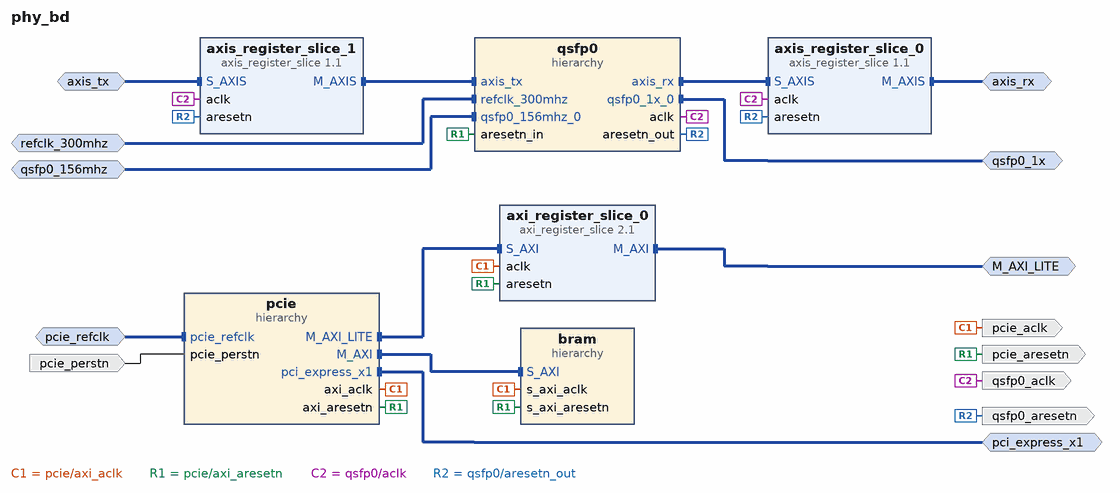
[diagram p0: block diagram of the top level]
# Vivado block design phy_bd, xcu200-fsgd2104-2-e, Vivado 2019.1.3
create_bd_design phy_bd

create_bd_intf_port -mode Master -vlnv xilinx.com:interface:pcie_7x_mgt_rtl:1.0 pci_express_x1
create_bd_intf_port -mode Slave -vlnv xilinx.com:interface:diff_clock_rtl:1.0 pcie_refclk
create_bd_intf_port -mode Slave -vlnv xilinx.com:interface:diff_clock_rtl:1.0 qsfp0_156mhz
set_property -dict {CONFIG.FREQ_HZ 156250000} [get_bd_intf_ports qsfp0_156mhz]
create_bd_intf_port -mode Master -vlnv xilinx.com:interface:gt_rtl:1.0 qsfp0_1x
create_bd_intf_port -mode Slave -vlnv xilinx.com:interface:diff_clock_rtl:1.0 refclk_300mhz
create_bd_intf_port -mode Master -vlnv xilinx.com:interface:aximm_rtl:1.0 M_AXI_LITE
set_property -dict [list \
  CONFIG.ADDR_WIDTH 32 \
  CONFIG.DATA_WIDTH 32 \
  CONFIG.FREQ_HZ 62500000 \
  CONFIG.HAS_BURST 0 \
  CONFIG.HAS_CACHE 0 \
  CONFIG.HAS_LOCK 0 \
  CONFIG.HAS_QOS 0 \
  CONFIG.HAS_REGION 0 \
  CONFIG.PROTOCOL AXI4LITE \
] [get_bd_intf_ports M_AXI_LITE]
create_bd_intf_port -mode Master -vlnv xilinx.com:interface:axis_rtl:1.0 axis_rx
set_property -dict {CONFIG.FREQ_HZ 156250000 CONFIG.PHASE 0} [get_bd_intf_ports axis_rx]
create_bd_intf_port -mode Slave -vlnv xilinx.com:interface:axis_rtl:1.0 axis_tx
set_property -dict [list \
  CONFIG.FREQ_HZ 156250000 \
  CONFIG.HAS_TKEEP 1 \
  CONFIG.HAS_TLAST 1 \
  CONFIG.HAS_TREADY 1 \
  CONFIG.HAS_TSTRB 0 \
  CONFIG.LAYERED_METADATA undef \
  CONFIG.PHASE 0 \
  CONFIG.TDATA_NUM_BYTES 8 \
  CONFIG.TDEST_WIDTH 0 \
  CONFIG.TID_WIDTH 0 \
  CONFIG.TUSER_WIDTH 1 \
] [get_bd_intf_ports axis_tx]
create_bd_port -dir I -type rst pcie_perstn
set_property -dict {CONFIG.POLARITY ACTIVE_LOW} [get_bd_ports pcie_perstn]
create_bd_port -dir O -type clk pcie_aclk
create_bd_port -dir O pcie_aresetn
create_bd_port -dir O qsfp0_aclk
create_bd_port -dir O qsfp0_aresetn

create_bd_cell -type hier bram
create_bd_cell -type hier pcie
create_bd_cell -type hier qsfp0
create_bd_cell -type ip -vlnv xilinx.com:ip:axi_register_slice:2.1 axi_register_slice_0
set_property -dict [list \
  CONFIG.REG_AR 7 \
  CONFIG.REG_AW 7 \
  CONFIG.REG_B 7 \
  CONFIG.REG_R 7 \
  CONFIG.REG_W 7 \
  CONFIG.USE_AUTOPIPELINING 1 \
] [get_bd_cells axi_register_slice_0]
create_bd_cell -type ip -vlnv xilinx.com:ip:axis_register_slice:1.1 axis_register_slice_0
create_bd_cell -type ip -vlnv xilinx.com:ip:axis_register_slice:1.1 axis_register_slice_1
set_property -dict {CONFIG.REG_CONFIG 12} [get_bd_cells axis_register_slice_1]

# ---- hierarchy /bram ----
current_bd_instance /bram
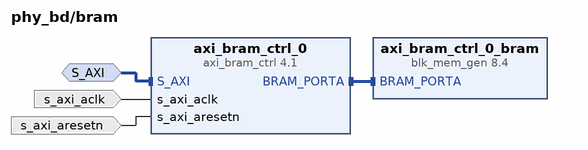
[diagram p1: block diagram inside /bram]
create_bd_intf_pin -mode Slave -vlnv xilinx.com:interface:aximm_rtl:1.0 S_AXI
create_bd_pin -dir I -type clk s_axi_aclk
create_bd_pin -dir I -type rst s_axi_aresetn

create_bd_cell -type ip -vlnv xilinx.com:ip:axi_bram_ctrl:4.1 axi_bram_ctrl_0
set_property -dict {CONFIG.DATA_WIDTH 64 CONFIG.SINGLE_PORT_BRAM 1} [get_bd_cells axi_bram_ctrl_0]
create_bd_cell -type ip -vlnv xilinx.com:ip:blk_mem_gen:8.4 axi_bram_ctrl_0_bram

# ---- hierarchy /pcie ----
current_bd_instance /pcie
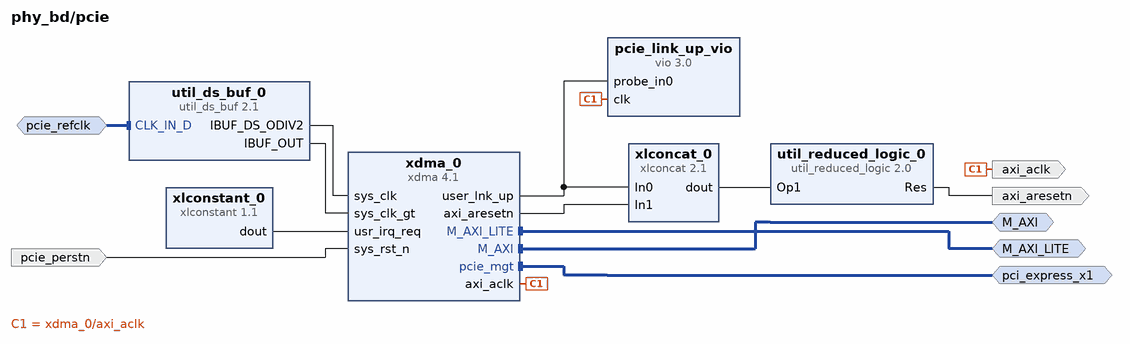
[diagram p2: block diagram inside /pcie]
create_bd_intf_pin -mode Master -vlnv xilinx.com:interface:aximm_rtl:1.0 M_AXI
create_bd_intf_pin -mode Master -vlnv xilinx.com:interface:aximm_rtl:1.0 M_AXI_LITE
create_bd_intf_pin -mode Master -vlnv xilinx.com:interface:pcie_7x_mgt_rtl:1.0 pci_express_x1
create_bd_intf_pin -mode Slave -vlnv xilinx.com:interface:diff_clock_rtl:1.0 pcie_refclk
create_bd_pin -dir O -type clk axi_aclk
create_bd_pin -dir O axi_aresetn
create_bd_pin -dir I -type rst pcie_perstn

create_bd_cell -type ip -vlnv xilinx.com:ip:vio:3.0 pcie_link_up_vio
set_property -dict {CONFIG.C_NUM_PROBE_OUT 0} [get_bd_cells pcie_link_up_vio]
create_bd_cell -type ip -vlnv xilinx.com:ip:util_ds_buf:2.1 util_ds_buf_0
set_property -dict {CONFIG.DIFF_CLK_IN_BOARD_INTERFACE pcie_refclk} [get_bd_cells util_ds_buf_0]
create_bd_cell -type ip -vlnv xilinx.com:ip:util_reduced_logic:2.0 util_reduced_logic_0
set_property -dict {CONFIG.C_SIZE 2} [get_bd_cells util_reduced_logic_0]
create_bd_cell -type ip -vlnv xilinx.com:ip:xdma:4.1 xdma_0
set_property -dict [list \
  CONFIG.PCIE_BOARD_INTERFACE pci_express_x1 \
  CONFIG.PF0_DEVICE_ID_mqdma 9011 \
  CONFIG.PF2_DEVICE_ID_mqdma 9011 \
  CONFIG.PF3_DEVICE_ID_mqdma 9011 \
  CONFIG.SYS_RST_N_BOARD_INTERFACE pcie_perstn \
  CONFIG.axi_data_width 64_bit \
  CONFIG.axi_id_width 2 \
  CONFIG.axilite_master_en true \
  CONFIG.axilite_master_size 16 \
  CONFIG.axist_bypass_en false \
  CONFIG.axisten_freq 62.5 \
  CONFIG.cfg_ext_if false \
  CONFIG.cfg_mgmt_if false \
  CONFIG.dsc_bypass_rd 0000 \
  CONFIG.enable_pcie_debug False \
  CONFIG.functional_mode DMA \
  CONFIG.mcap_enablement None \
  CONFIG.mode_selection Advanced \
  CONFIG.pcie_extended_tag false \
  CONFIG.pf0_device_id 9011 \
  CONFIG.pf0_interrupt_pin INTA \
  CONFIG.pf0_msi_enabled false \
  CONFIG.pf0_msix_enabled false \
  CONFIG.pf0_rbar_cap_bar0 0x00000000fff0 \
  CONFIG.pf1_rbar_cap_bar0 0x00000000fff0 \
  CONFIG.pf2_rbar_cap_bar0 0x00000000fff0 \
  CONFIG.pf3_rbar_cap_bar0 0x00000000fff0 \
  CONFIG.pl_link_cap_max_link_speed 2.5_GT/s \
  CONFIG.xdma_axi_intf_mm AXI_Memory_Mapped \
  CONFIG.xdma_axilite_slave false \
  CONFIG.xdma_num_usr_irq 1 \
  CONFIG.xdma_rnum_chnl 1 \
  CONFIG.xdma_rnum_rids 2 \
  CONFIG.xdma_wnum_chnl 1 \
  CONFIG.xdma_wnum_rids 2 \
] [get_bd_cells xdma_0]
create_bd_cell -type ip -vlnv xilinx.com:ip:xlconcat:2.1 xlconcat_0
create_bd_cell -type ip -vlnv xilinx.com:ip:xlconstant:1.1 xlconstant_0
set_property -dict {CONFIG.CONST_VAL 0} [get_bd_cells xlconstant_0]

# ---- hierarchy /qsfp0 ----
current_bd_instance /qsfp0
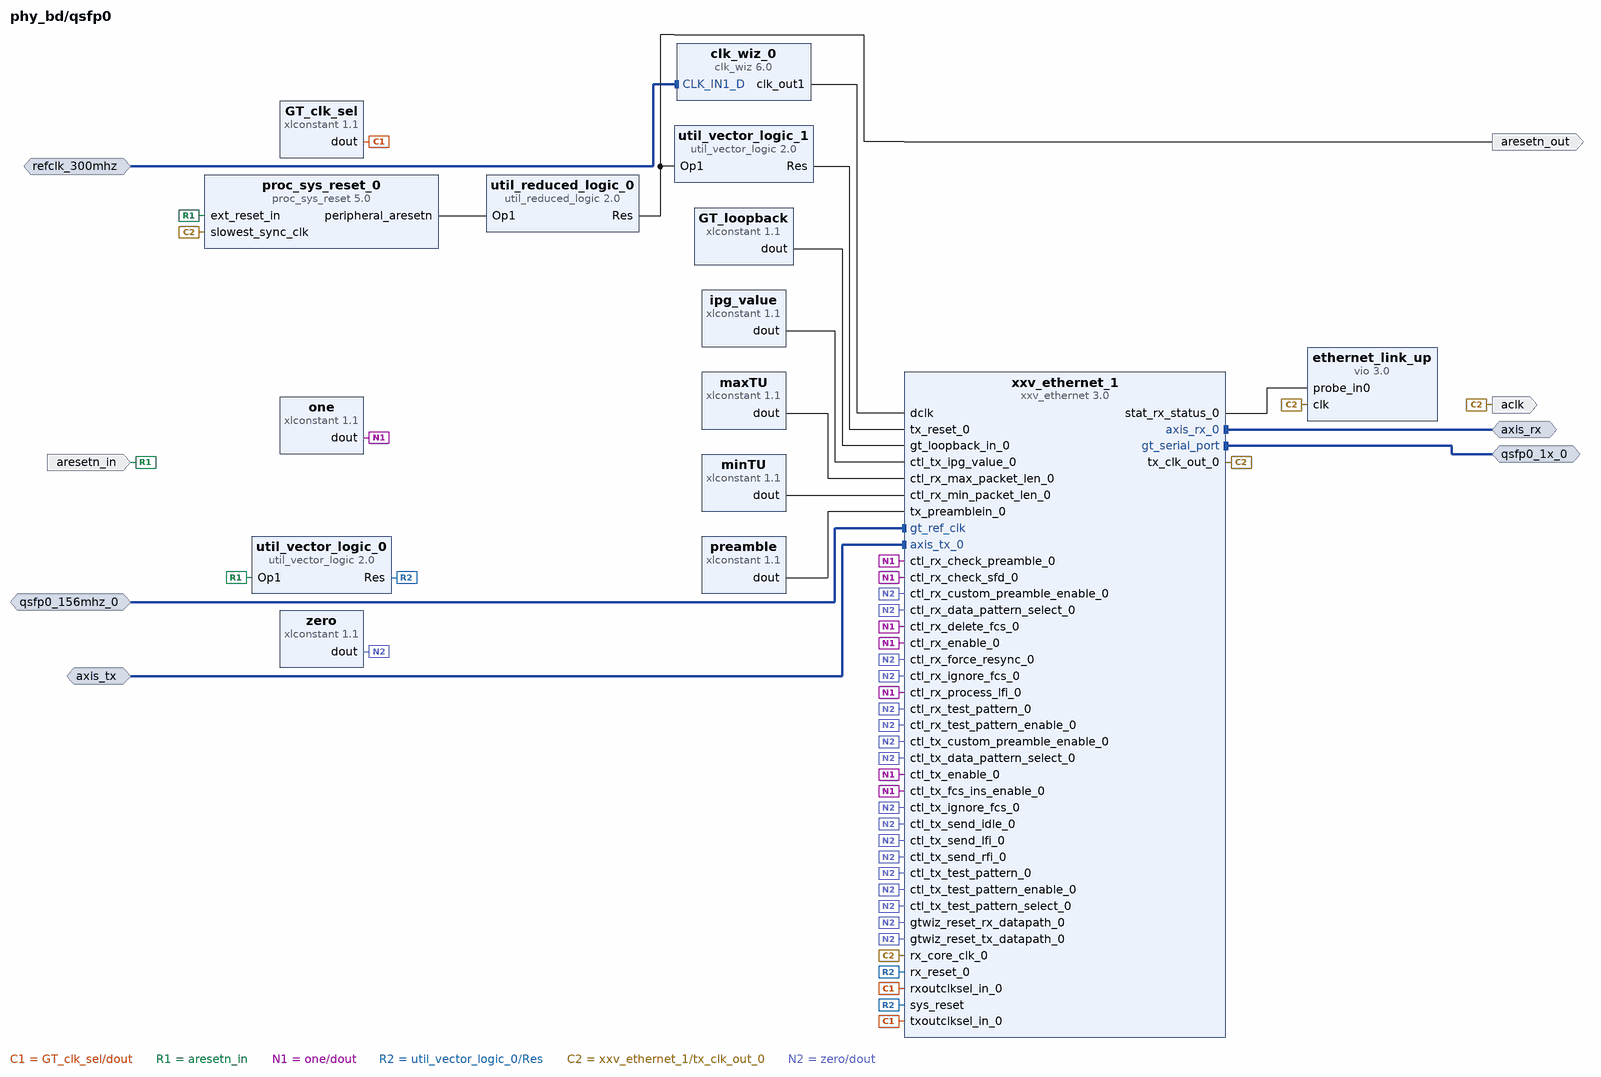
[diagram p3: block diagram inside /qsfp0]
create_bd_intf_pin -mode Master -vlnv xilinx.com:interface:axis_rtl:1.0 axis_rx
create_bd_intf_pin -mode Slave -vlnv xilinx.com:interface:axis_rtl:1.0 axis_tx
create_bd_intf_pin -mode Slave -vlnv xilinx.com:interface:diff_clock_rtl:1.0 qsfp0_156mhz_0
create_bd_intf_pin -mode Master -vlnv xilinx.com:interface:gt_rtl:1.0 qsfp0_1x_0
create_bd_intf_pin -mode Slave -vlnv xilinx.com:interface:diff_clock_rtl:1.0 refclk_300mhz
create_bd_pin -dir O aclk
create_bd_pin -dir I -type rst aresetn_in
create_bd_pin -dir O aresetn_out

create_bd_cell -type ip -vlnv xilinx.com:ip:xlconstant:1.1 GT_clk_sel
set_property -dict {CONFIG.CONST_VAL 5 CONFIG.CONST_WIDTH 3} [get_bd_cells GT_clk_sel]
create_bd_cell -type ip -vlnv xilinx.com:ip:xlconstant:1.1 GT_loopback
set_property -dict {CONFIG.CONST_VAL 0 CONFIG.CONST_WIDTH 3} [get_bd_cells GT_loopback]
create_bd_cell -type ip -vlnv xilinx.com:ip:clk_wiz:6.0 clk_wiz_0
set_property -dict [list \
  CONFIG.CLKIN1_JITTER_PS 33.330000000000005 \
  CONFIG.CLKOUT1_DRIVES BUFGCE \
  CONFIG.CLKOUT1_JITTER 107.379 \
  CONFIG.CLKOUT1_PHASE_ERROR 77.836 \
  CONFIG.CLKOUT1_REQUESTED_OUT_FREQ 75 \
  CONFIG.CLKOUT2_DRIVES BUFGCE \
  CONFIG.CLKOUT3_DRIVES BUFGCE \
  CONFIG.CLKOUT4_DRIVES BUFGCE \
  CONFIG.CLKOUT5_DRIVES BUFGCE \
  CONFIG.CLKOUT6_DRIVES BUFGCE \
  CONFIG.CLKOUT7_DRIVES BUFGCE \
  CONFIG.CLK_IN1_BOARD_INTERFACE default_300mhz_clk0 \
  CONFIG.FEEDBACK_SOURCE FDBK_AUTO \
  CONFIG.MMCM_CLKFBOUT_MULT_F 4.000 \
  CONFIG.MMCM_CLKIN1_PERIOD 3.333 \
  CONFIG.MMCM_CLKIN2_PERIOD 10.0 \
  CONFIG.MMCM_CLKOUT0_DIVIDE_F 16.000 \
  CONFIG.MMCM_DIVCLK_DIVIDE 1 \
  CONFIG.PRIM_SOURCE Differential_clock_capable_pin \
  CONFIG.RESET_PORT reset \
  CONFIG.RESET_TYPE ACTIVE_HIGH \
  CONFIG.USE_LOCKED false \
  CONFIG.USE_RESET false \
  CONFIG.USE_SAFE_CLOCK_STARTUP true \
] [get_bd_cells clk_wiz_0]
create_bd_cell -type ip -vlnv xilinx.com:ip:vio:3.0 ethernet_link_up
set_property -dict {CONFIG.C_NUM_PROBE_OUT 0 CONFIG.C_PROBE_OUT0_INIT_VAL 0x1} [get_bd_cells ethernet_link_up]
create_bd_cell -type ip -vlnv xilinx.com:ip:xlconstant:1.1 ipg_value
set_property -dict {CONFIG.CONST_VAL 8 CONFIG.CONST_WIDTH 4} [get_bd_cells ipg_value]
create_bd_cell -type ip -vlnv xilinx.com:ip:xlconstant:1.1 maxTU
set_property -dict {CONFIG.CONST_VAL 1500 CONFIG.CONST_WIDTH 15} [get_bd_cells maxTU]
create_bd_cell -type ip -vlnv xilinx.com:ip:xlconstant:1.1 minTU
set_property -dict {CONFIG.CONST_VAL 64 CONFIG.CONST_WIDTH 8} [get_bd_cells minTU]
create_bd_cell -type ip -vlnv xilinx.com:ip:xlconstant:1.1 one
create_bd_cell -type ip -vlnv xilinx.com:ip:xlconstant:1.1 preamble
set_property -dict {CONFIG.CONST_VAL 0 CONFIG.CONST_WIDTH 56} [get_bd_cells preamble]
create_bd_cell -type ip -vlnv xilinx.com:ip:proc_sys_reset:5.0 proc_sys_reset_0
set_property -dict {CONFIG.C_AUX_RST_WIDTH 1 CONFIG.C_EXT_RST_WIDTH 1} [get_bd_cells proc_sys_reset_0]
create_bd_cell -type ip -vlnv xilinx.com:ip:util_reduced_logic:2.0 util_reduced_logic_0
set_property -dict {CONFIG.C_SIZE 1} [get_bd_cells util_reduced_logic_0]
create_bd_cell -type ip -vlnv xilinx.com:ip:util_vector_logic:2.0 util_vector_logic_0
set_property -dict {CONFIG.C_OPERATION not CONFIG.C_SIZE 1} [get_bd_cells util_vector_logic_0]
create_bd_cell -type ip -vlnv xilinx.com:ip:xxv_ethernet:3.0 xxv_ethernet_1
set_property -dict [list \
  CONFIG.BASE_R_KR BASE-R \
  CONFIG.DIFFCLK_BOARD_INTERFACE qsfp0_156mhz \
  CONFIG.ETHERNET_BOARD_INTERFACE qsfp0_1x \
  CONFIG.INCLUDE_AXI4_INTERFACE 0 \
  CONFIG.INCLUDE_USER_FIFO 1 \
  CONFIG.USE_BOARD_FLOW true \
] [get_bd_cells xxv_ethernet_1]
create_bd_cell -type ip -vlnv xilinx.com:ip:xlconstant:1.1 zero
set_property -dict {CONFIG.CONST_VAL 0} [get_bd_cells zero]
create_bd_cell -type ip -vlnv xilinx.com:ip:util_vector_logic:2.0 util_vector_logic_1
set_property -dict {CONFIG.C_OPERATION not CONFIG.C_SIZE 1} [get_bd_cells util_vector_logic_1]

# ---- connections ----

current_bd_instance /bram
connect_bd_intf_net -intf_net pcie_M_AXI [get_bd_intf_pins S_AXI] [get_bd_intf_pins axi_bram_ctrl_0/S_AXI]
connect_bd_intf_net [get_bd_intf_pins axi_bram_ctrl_0/BRAM_PORTA] [get_bd_intf_pins axi_bram_ctrl_0_bram/BRAM_PORTA]
connect_bd_net -net pcie_axi_aclk [get_bd_pins s_axi_aclk] [get_bd_pins axi_bram_ctrl_0/s_axi_aclk]
connect_bd_net -net pcie_axi_aresetn [get_bd_pins s_axi_aresetn] [get_bd_pins axi_bram_ctrl_0/s_axi_aresetn]

current_bd_instance /pcie
connect_bd_intf_net [get_bd_intf_pins pcie_refclk] [get_bd_intf_pins util_ds_buf_0/CLK_IN_D]
connect_bd_intf_net [get_bd_intf_pins M_AXI_LITE] [get_bd_intf_pins xdma_0/M_AXI_LITE]
connect_bd_intf_net [get_bd_intf_pins M_AXI] [get_bd_intf_pins xdma_0/M_AXI]
connect_bd_intf_net [get_bd_intf_pins pci_express_x1] [get_bd_intf_pins xdma_0/pcie_mgt]
connect_bd_net [get_bd_pins pcie_perstn] [get_bd_pins xdma_0/sys_rst_n]
connect_bd_net -net pcie_user_lnk_up_vio [get_bd_pins xdma_0/user_lnk_up] [get_bd_pins pcie_link_up_vio/probe_in0] [get_bd_pins xlconcat_0/In0]
connect_bd_net [get_bd_pins util_ds_buf_0/IBUF_DS_ODIV2] [get_bd_pins xdma_0/sys_clk]
connect_bd_net [get_bd_pins util_ds_buf_0/IBUF_OUT] [get_bd_pins xdma_0/sys_clk_gt]
connect_bd_net [get_bd_pins util_reduced_logic_0/Res] [get_bd_pins axi_aresetn]
connect_bd_net [get_bd_pins xdma_0/axi_aclk] [get_bd_pins axi_aclk] [get_bd_pins pcie_link_up_vio/clk]
connect_bd_net [get_bd_pins xdma_0/axi_aresetn] [get_bd_pins xlconcat_0/In1]
connect_bd_net [get_bd_pins xlconcat_0/dout] [get_bd_pins util_reduced_logic_0/Op1]
connect_bd_net [get_bd_pins xlconstant_0/dout] [get_bd_pins xdma_0/usr_irq_req]

current_bd_instance /qsfp0
connect_bd_intf_net [get_bd_intf_pins qsfp0_156mhz_0] [get_bd_intf_pins xxv_ethernet_1/gt_ref_clk]
connect_bd_intf_net -intf_net refclk_300M_1 [get_bd_intf_pins refclk_300mhz] [get_bd_intf_pins clk_wiz_0/CLK_IN1_D]
connect_bd_intf_net [get_bd_intf_pins axis_rx] [get_bd_intf_pins xxv_ethernet_1/axis_rx_0]
connect_bd_intf_net [get_bd_intf_pins axis_tx] [get_bd_intf_pins xxv_ethernet_1/axis_tx_0]
connect_bd_intf_net [get_bd_intf_pins qsfp0_1x_0] [get_bd_intf_pins xxv_ethernet_1/gt_serial_port]
connect_bd_net [get_bd_pins GT_clk_sel/dout] [get_bd_pins xxv_ethernet_1/rxoutclksel_in_0] [get_bd_pins xxv_ethernet_1/txoutclksel_in_0]
connect_bd_net [get_bd_pins GT_loopback/dout] [get_bd_pins xxv_ethernet_1/gt_loopback_in_0]
connect_bd_net -net aresetn_in_1 [get_bd_pins proc_sys_reset_0/peripheral_aresetn] [get_bd_pins util_reduced_logic_0/Op1]
connect_bd_net [get_bd_pins clk_wiz_0/clk_out1] [get_bd_pins xxv_ethernet_1/dclk]
connect_bd_net -net ethernet_link_up_vio [get_bd_pins xxv_ethernet_1/stat_rx_status_0] [get_bd_pins ethernet_link_up/probe_in0]
connect_bd_net -net ext_reset_in_1 [get_bd_pins aresetn_in] [get_bd_pins proc_sys_reset_0/ext_reset_in] [get_bd_pins util_vector_logic_0/Op1]
connect_bd_net [get_bd_pins ipg_value/dout] [get_bd_pins xxv_ethernet_1/ctl_tx_ipg_value_0]
connect_bd_net [get_bd_pins maxTU/dout] [get_bd_pins xxv_ethernet_1/ctl_rx_max_packet_len_0]
connect_bd_net [get_bd_pins minTU/dout] [get_bd_pins xxv_ethernet_1/ctl_rx_min_packet_len_0]
connect_bd_net [get_bd_pins one/dout] \
  [get_bd_pins xxv_ethernet_1/ctl_rx_check_preamble_0] [get_bd_pins xxv_ethernet_1/ctl_rx_check_sfd_0] \
  [get_bd_pins xxv_ethernet_1/ctl_rx_delete_fcs_0] [get_bd_pins xxv_ethernet_1/ctl_rx_enable_0] \
  [get_bd_pins xxv_ethernet_1/ctl_rx_process_lfi_0] [get_bd_pins xxv_ethernet_1/ctl_tx_enable_0] \
  [get_bd_pins xxv_ethernet_1/ctl_tx_fcs_ins_enable_0]
connect_bd_net [get_bd_pins preamble/dout] [get_bd_pins xxv_ethernet_1/tx_preamblein_0]
connect_bd_net [get_bd_pins util_reduced_logic_0/Res] [get_bd_pins aresetn_out] [get_bd_pins util_vector_logic_1/Op1]
connect_bd_net [get_bd_pins util_vector_logic_0/Res] [get_bd_pins xxv_ethernet_1/rx_reset_0] [get_bd_pins xxv_ethernet_1/sys_reset]
connect_bd_net [get_bd_pins xxv_ethernet_1/tx_clk_out_0] \
  [get_bd_pins aclk] [get_bd_pins proc_sys_reset_0/slowest_sync_clk] [get_bd_pins xxv_ethernet_1/rx_core_clk_0] \
  [get_bd_pins ethernet_link_up/clk]
connect_bd_net [get_bd_pins zero/dout] \
  [get_bd_pins xxv_ethernet_1/ctl_rx_custom_preamble_enable_0] [get_bd_pins xxv_ethernet_1/ctl_rx_data_pattern_select_0] \
  [get_bd_pins xxv_ethernet_1/ctl_rx_force_resync_0] [get_bd_pins xxv_ethernet_1/ctl_rx_ignore_fcs_0] \
  [get_bd_pins xxv_ethernet_1/ctl_rx_test_pattern_0] [get_bd_pins xxv_ethernet_1/ctl_rx_test_pattern_enable_0] \
  [get_bd_pins xxv_ethernet_1/ctl_tx_custom_preamble_enable_0] [get_bd_pins xxv_ethernet_1/ctl_tx_data_pattern_select_0] \
  [get_bd_pins xxv_ethernet_1/ctl_tx_ignore_fcs_0] [get_bd_pins xxv_ethernet_1/ctl_tx_send_idle_0] \
  [get_bd_pins xxv_ethernet_1/ctl_tx_send_lfi_0] [get_bd_pins xxv_ethernet_1/ctl_tx_send_rfi_0] \
  [get_bd_pins xxv_ethernet_1/ctl_tx_test_pattern_0] [get_bd_pins xxv_ethernet_1/ctl_tx_test_pattern_enable_0] \
  [get_bd_pins xxv_ethernet_1/ctl_tx_test_pattern_select_0] [get_bd_pins xxv_ethernet_1/gtwiz_reset_rx_datapath_0] \
  [get_bd_pins xxv_ethernet_1/gtwiz_reset_tx_datapath_0]
connect_bd_net [get_bd_pins util_vector_logic_1/Res] [get_bd_pins xxv_ethernet_1/tx_reset_0]

current_bd_instance /
connect_bd_intf_net [get_bd_intf_ports M_AXI_LITE] [get_bd_intf_pins axi_register_slice_0/M_AXI]
connect_bd_intf_net [get_bd_intf_pins qsfp0/axis_rx] [get_bd_intf_pins axis_register_slice_0/S_AXIS]
connect_bd_intf_net [get_bd_intf_ports axis_rx] [get_bd_intf_pins axis_register_slice_0/M_AXIS]
connect_bd_intf_net [get_bd_intf_pins axis_register_slice_1/M_AXIS] [get_bd_intf_pins qsfp0/axis_tx]
connect_bd_intf_net [get_bd_intf_ports axis_tx] [get_bd_intf_pins axis_register_slice_1/S_AXIS]
connect_bd_intf_net -intf_net refclk_300M_1 [get_bd_intf_ports refclk_300mhz] [get_bd_intf_pins qsfp0/refclk_300mhz]
connect_bd_intf_net [get_bd_intf_pins bram/S_AXI] [get_bd_intf_pins pcie/M_AXI]
connect_bd_intf_net [get_bd_intf_ports qsfp0_1x] [get_bd_intf_pins qsfp0/qsfp0_1x_0]
connect_bd_intf_net [get_bd_intf_ports pcie_refclk] [get_bd_intf_pins pcie/pcie_refclk]
connect_bd_intf_net [get_bd_intf_pins pcie/M_AXI_LITE] [get_bd_intf_pins axi_register_slice_0/S_AXI]
connect_bd_intf_net -intf_net xdma_0_pcie_mgt [get_bd_intf_ports pci_express_x1] [get_bd_intf_pins pcie/pci_express_x1]
connect_bd_intf_net -intf_net qsfp0_156mhz_0_1 [get_bd_intf_ports qsfp0_156mhz] [get_bd_intf_pins qsfp0/qsfp0_156mhz_0]
connect_bd_net [get_bd_pins pcie/axi_aclk] [get_bd_pins bram/s_axi_aclk] [get_bd_ports pcie_aclk] [get_bd_pins axi_register_slice_0/aclk]
connect_bd_net [get_bd_pins pcie/axi_aresetn] \
  [get_bd_pins bram/s_axi_aresetn] [get_bd_pins qsfp0/aresetn_in] [get_bd_ports pcie_aresetn] \
  [get_bd_pins axi_register_slice_0/aresetn]
connect_bd_net [get_bd_ports pcie_perstn] [get_bd_pins pcie/pcie_perstn]
connect_bd_net [get_bd_pins qsfp0/aclk] [get_bd_ports qsfp0_aclk] [get_bd_pins axis_register_slice_0/aclk] [get_bd_pins axis_register_slice_1/aclk]
connect_bd_net [get_bd_pins qsfp0/aresetn_out] \
  [get_bd_ports qsfp0_aresetn] [get_bd_pins axis_register_slice_0/aresetn] [get_bd_pins axis_register_slice_1/aresetn]

# ---- address map ----
assign_bd_address -offset 0x00000000C0000000 -range 16K -target_address_space [get_bd_addr_spaces pcie/xdma_0/M_AXI] [get_bd_addr_segs bram/axi_bram_ctrl_0/S_AXI/Mem0]
assign_bd_address -offset 0x00000000 -range 16M -target_address_space [get_bd_addr_spaces pcie/xdma_0/M_AXI_LITE] [get_bd_addr_segs M_AXI_LITE/Reg]

validate_bd_design
save_bd_design
